# EAGLE design final (EAGLE 8.2.2)
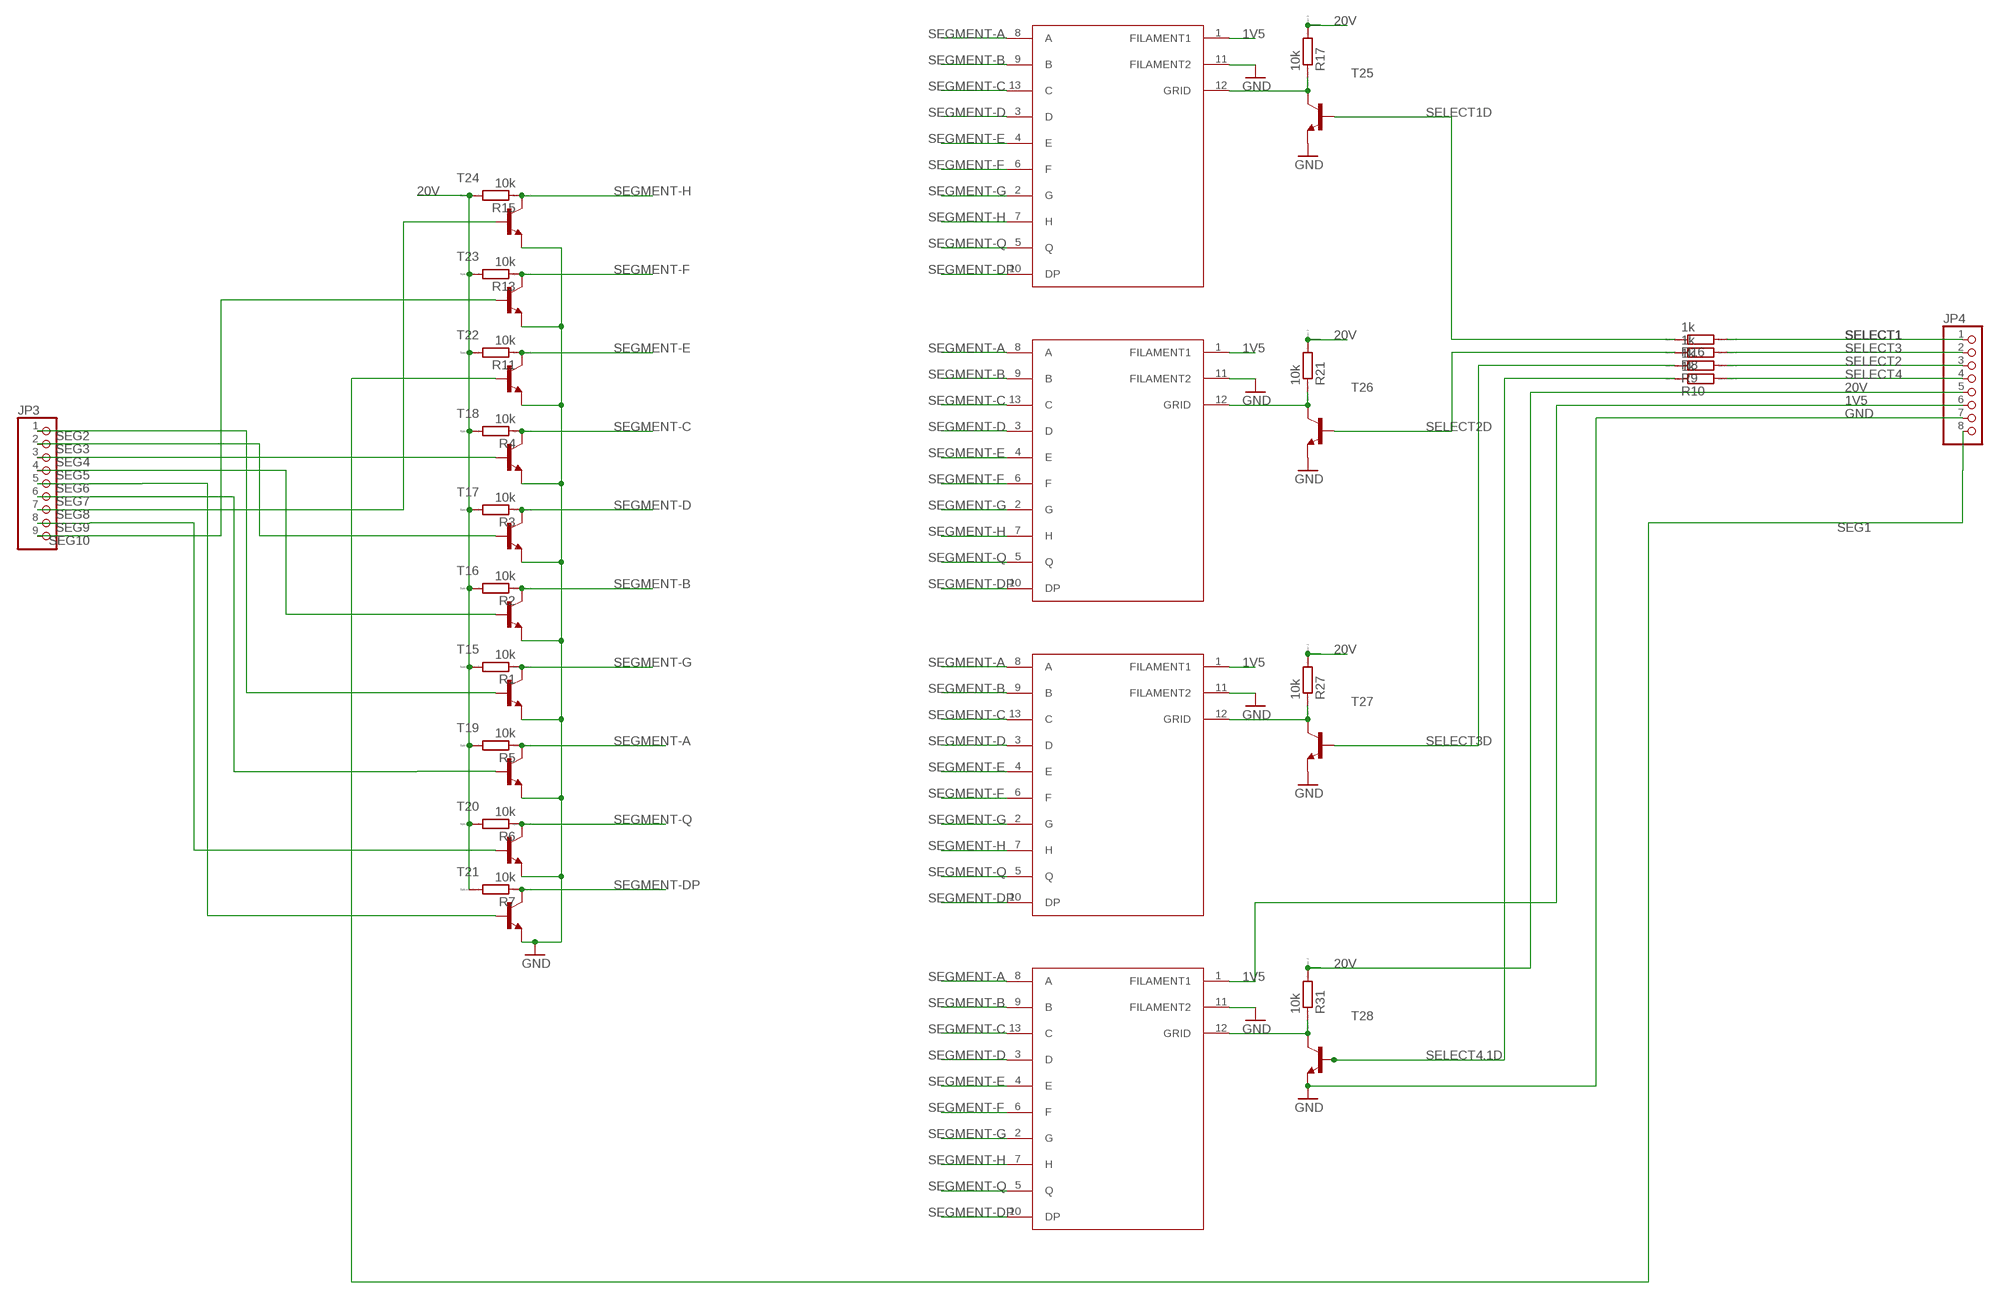
[diagram p0: schematic, sheet 1, part 1 of 2]
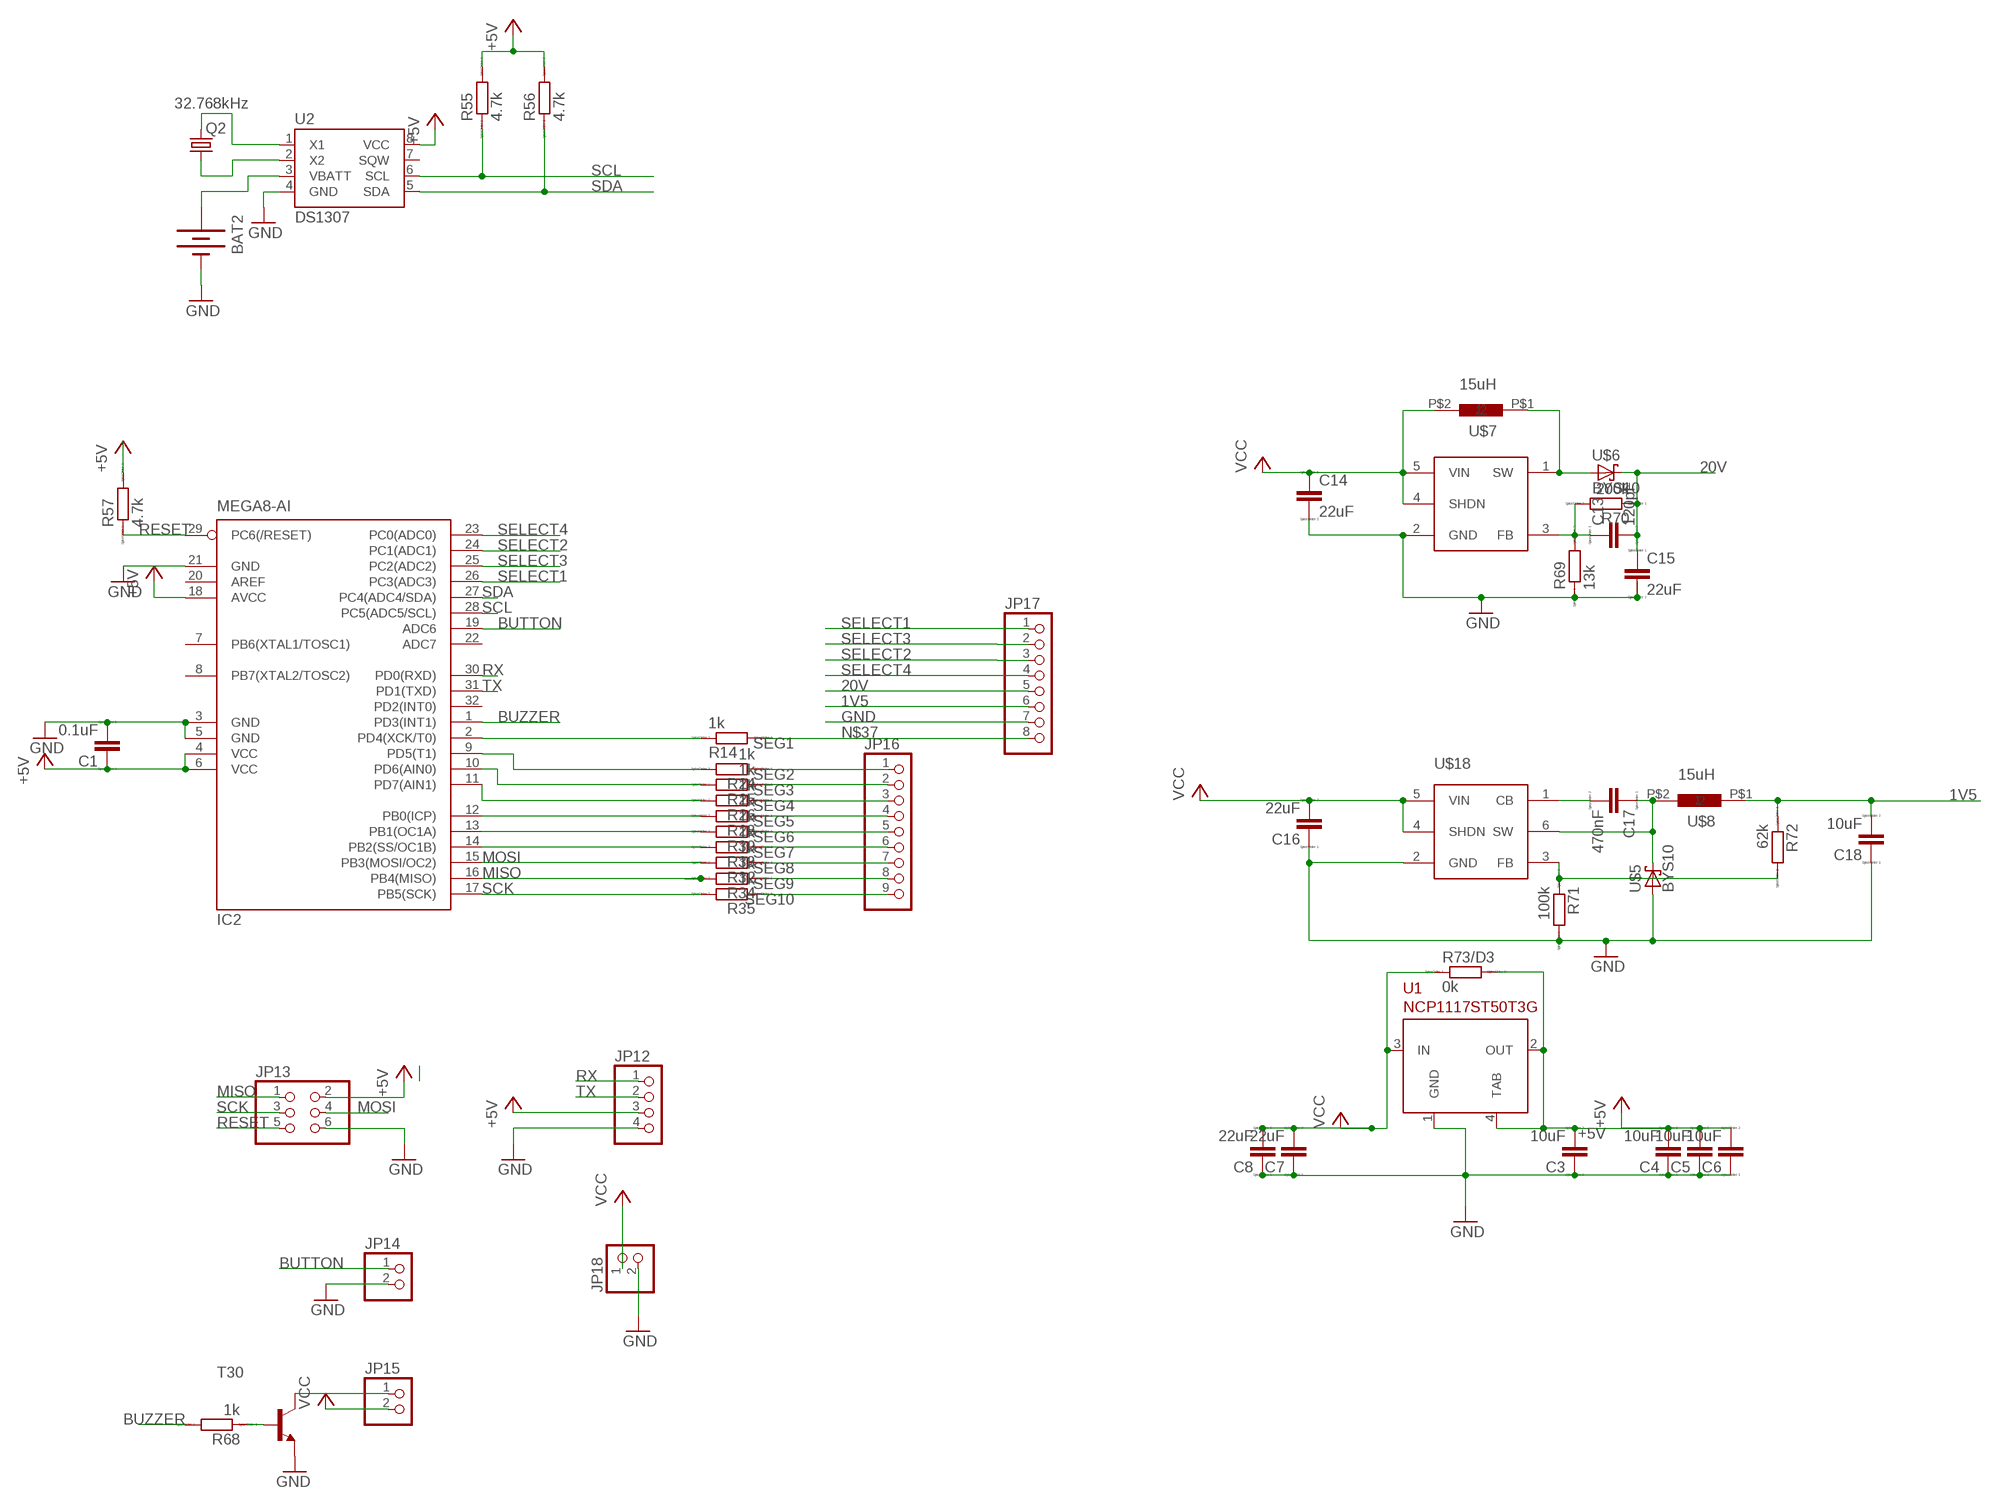
[diagram p1: schematic, sheet 1, part 2 of 2]

## Parts
BAT2  BATTERY12PTH  [BATTCON_12MM_PTH]
C1  0.1uF  CC1206  [C1206]
C3  10uF  CC1206  [C1206]
C4  10uF  CC1206  [C1206]
C5  10uF  CC1206  [C1206]
C6  10uF  CC1206  [C1206]
C7  22uF  CC1206  [C1206]
C8  22uF  CC1206  [C1206]
C13  120pF  CC1206  [C1206]
C14  22uF  CC1206  [C1206]
C15  22uF  CC1206  [C1206]
C16  22uF  CC1206  [C1206]
C17  470nF  CC1206  [C1206]
C18  10uF  CC1206  [C1206]
IC2  MEGA8-AI  [TQFP32-08]
JP3  PINHD-1X9  [1X09]
JP4  PINHD-1X8  [1X08]
JP12  PINHD-1X04_2.54-S  [1X04-S]
JP13  PINHD-2X03_2.54  [2X03]
JP14  PINHD-1X02_2.54  [1X02]
JP15  PINHD-1X02_2.54  [1X02]
JP16  PINHD-1X9  [1X09]
JP17  PINHD-1X8  [1X08]
JP18  PINHD-1X2  [1X02]
Q2  32.768kHz  CRYSTAL32-SMD  [CRYSTAL-32KHZ-SMD]
R1  10k  RR1206  [R1206]
R2  10k  RR1206  [R1206]
R3  10k  RR1206  [R1206]
R4  10k  RR1206  [R1206]
R5  10k  RR1206  [R1206]
R6  10k  RR1206  [R1206]
R7  10k  RR1206  [R1206]
R8  1k  RR1206  [R1206]
R9  1k  RR1206  [R1206]
R10  1k  RR1206  [R1206]
R11  10k  RR1206  [R1206]
R13  10k  RR1206  [R1206]
R14  1k  RR1206  [R1206]
R15  10k  RR1206  [R1206]
R16  1k  RR1206  [R1206]
R17  10k  RR1206  [R1206]
R21  10k  RR1206  [R1206]
R24  1k  RR1206  [R1206]
R25  1k  RR1206  [R1206]
R26  1k  RR1206  [R1206]
R27  10k  RR1206  [R1206]
R28  1k  RR1206  [R1206]
R30  1k  RR1206  [R1206]
R31  10k  RR1206  [R1206]
R32  1k  RR1206  [R1206]
R33  1k  RR1206  [R1206]
R34  1k  RR1206  [R1206]
R35  1k  RR1206  [R1206]
R55  4.7k  RR1206  [R1206]
R56  4.7k  RR1206  [R1206]
R57  4.7k  RR1206  [R1206]
R68  1k  RR1206  [R1206]
R69  13k  RR1206  [R1206]
R70  200k  RR1206  [R1206]
R71  100k  RR1206  [R1206]
R72  62k  RR1206  [R1206]
R73/D3  0k  RR1206  [R1206]
T15  BC817-25-NPN-SOT23-BEC  [SOT23-BEC]
T16  BC817-25-NPN-SOT23-BEC  [SOT23-BEC]
T17  BC817-25-NPN-SOT23-BEC  [SOT23-BEC]
T18  BC817-25-NPN-SOT23-BEC  [SOT23-BEC]
T19  BC817-25-NPN-SOT23-BEC  [SOT23-BEC]
T20  BC817-25-NPN-SOT23-BEC  [SOT23-BEC]
T21  BC817-25-NPN-SOT23-BEC  [SOT23-BEC]
T22  BC817-25-NPN-SOT23-BEC  [SOT23-BEC]
T23  BC817-25-NPN-SOT23-BEC  [SOT23-BEC]
T24  BC817-25-NPN-SOT23-BEC  [SOT23-BEC]
T25  BC817-25-NPN-SOT23-BEC  [SOT23-BEC]
T26  BC817-25-NPN-SOT23-BEC  [SOT23-BEC]
T27  BC817-25-NPN-SOT23-BEC  [SOT23-BEC]
T28  BC817-25-NPN-SOT23-BEC  [SOT23-BEC]
T30  BC817-25-NPN-SOT23-BEC  [SOT23-BEC]
U1  NCP1117ST50T3G  [SOT223]
U2  DS1307  DS1307SO8-TIGHT  [SO08-TIGHT]
U$1  VFD  [ROUND-THT]
U$2  VFD  [ROUND-THT]
U$3  VFD  [ROUND-THT]
U$4  VFD  [ROUND-THT]
U$5  BYS10  [DO-214AC]
U$6  BYS10  [DO-214AC]
U$7  15uH  INDUCTOR  [DJNR5020]
U$8  15uH  INDUCTOR  [DJNR5020]
U$15  LM27313DEV  [SOT-23]
U$18  LMR14206DEV  [SOT-23]

## Nets
1V5: C18.2 JP4.6 JP17.6 R72.1 U$1.1(FILAMENT1) U$2.1(FILAMENT1) U$3.1(FILAMENT1) U$4.1(FILAMENT1) U$8.P$1
20V: C13.2 C15.1 JP4.5 JP17.5 R1.2 R2.2 R3.2 R4.2 R5.2 R6.2 R7.2 R11.2 R13.2 R15.2 R17.2 R21.2 R27.2 R31.2 R70.1 U$6.2(C)
+5V: C1.1 C3.2 C4.2 C5.2 C6.2 IC2.4(VCC) IC2.6(VCC) IC2.18(AVCC) JP12.3 JP13.2 R55.2 R56.2 R57.2 R73/D3.2 U1.2(OUT) U1.4(TAB) U2.8(VCC)
BUTTON: IC2.19(ADC6) JP14.1
BUZZER: IC2.1(PD3(INT1)) R68.2
GND: BAT2.GND(-) C1.2 C3.1 C4.1 C5.1 C6.1 C7.1 C8.1 C14.2 C15.2 C16.1 C18.1 IC2.3(GND) IC2.5(GND) IC2.21(GND) JP4.7 JP12.4 JP13.6 JP14.2 JP17.7 JP18.2 R69.1 R71.2 T15.E T16.E T17.E T18.E T19.E T20.E T21.E T22.E T23.E T24.E T25.E T26.E T27.E T28.E T30.E U1.1(GND) U2.4(GND) U$1.11(FILAMENT2) U$2.11(FILAMENT2) U$3.11(FILAMENT2) U$4.11(FILAMENT2) U$5.1(A) U$15.2(GND) U$18.2(GND)
MISO: IC2.16(PB4(MISO)) JP13.1 R34.2
MOSI: IC2.15(PB3(MOSI/OC2)) JP13.4 R32.2
N$14: R17.1 T25.C U$1.12(GRID)
N$15: IC2.14(PB2(SS/OC1B)) R33.2
N$17: IC2.13(PB1(OC1A)) R30.2
N$18: R21.1 T26.C U$2.12(GRID)
N$19: IC2.12(PB0(ICP)) R28.2
N$21: IC2.11(PD7(AIN1)) R26.2
N$22: R27.1 T27.C U$3.12(GRID)
N$24: R31.1 T28.C U$4.12(GRID)
N$35: IC2.10(PD6(AIN0)) R25.2
N$36: IC2.9(PD5(T1)) R24.2
N$37: IC2.2(PD4(XCK/T0)) R14.1
N$69: Q2.X2 U2.1(X1)
N$70: Q2.X1 U2.2(X2)
N$71: BAT2.VCC@1(+) U2.3(VBATT)
N$79: JP15.1 T30.C
N$80: R68.1 T30.B
N$90: U$6.1(A) U$7.P$1 U$15.1(SW)
N$91: C13.1 R69.2 R70.2 U$15.3(FB)
N$92: R71.1 R72.2 U$18.3(FB)
N$93: C17.1 U$5.2(C) U$8.P$2 U$18.6(SW)
N$94: C17.2 U$18.1(CB)
RESET: IC2.29(PC6(/RESET)) JP13.5 R57.1
RX: IC2.30(PD0(RXD)) JP12.1
SCK: IC2.17(PB5(SCK)) JP13.3 R35.2
SCL: IC2.28(PC5(ADC5/SCL)) R55.1 U2.6(SCL)
SDA: IC2.27(PC4(ADC4/SDA)) R56.1 U2.5(SDA)
SEG1: JP4.8 JP17.8 R14.2 T22.B
SEG2: JP3.1 JP16.1 R24.1 T15.B
SEG3: JP3.2 JP16.2 R25.1 T17.B
SEG4: JP3.3 JP16.3 R26.1 T18.B
SEG5: JP3.4 JP16.4 R28.1 T16.B
SEG6: JP3.5 JP16.5 R30.1 T21.B
SEG7: JP3.6 JP16.6 R33.1 T19.B
SEG8: JP3.7 JP16.7 R32.1 T24.B
SEG9: JP3.8 JP16.8 R34.1 T20.B
SEG10: JP3.9 JP16.9 R35.1 T23.B
SEGMENT-A: R5.1 T19.C U$1.8(A) U$2.8(A) U$3.8(A) U$4.8(A)
SEGMENT-B: R2.1 T16.C U$1.9(B) U$2.9(B) U$3.9(B) U$4.9(B)
SEGMENT-C: R4.1 T18.C U$1.13(C) U$2.13(C) U$3.13(C) U$4.13(C)
SEGMENT-D: R3.1 T17.C U$1.3(D) U$2.3(D) U$3.3(D) U$4.3(D)
SEGMENT-DP: R7.1 T21.C U$1.10(DP) U$2.10(DP) U$3.10(DP) U$4.10(DP)
SEGMENT-E: R11.1 T22.C U$1.4(E) U$2.4(E) U$3.4(E) U$4.4(E)
SEGMENT-F: R13.1 T23.C U$1.6(F) U$2.6(F) U$3.6(F) U$4.6(F)
SEGMENT-G: R1.1 T15.C U$1.2(G) U$2.2(G) U$3.2(G) U$4.2(G)
SEGMENT-H: R15.1 T24.C U$1.7(H) U$2.7(H) U$3.7(H) U$4.7(H)
SEGMENT-Q: R6.1 T20.C U$1.5(Q) U$2.5(Q) U$3.5(Q) U$4.5(Q)
SELECT1: IC2.26(PC3(ADC3)) JP4.1 JP17.1 R16.2
SELECT1D: R16.1 T25.B
SELECT2: IC2.24(PC1(ADC1)) JP4.3 JP17.3 R9.2
SELECT2D: R8.1 T26.B
SELECT3: IC2.25(PC2(ADC2)) JP4.2 JP17.2 R8.2
SELECT3D: R9.1 T27.B
SELECT4: IC2.23(PC0(ADC0)) JP4.4 JP17.4 R10.2
SELECT4.1D: R10.1 T28.B
TX: IC2.31(PD1(TXD)) JP12.2
VCC: C7.2 C8.2 C14.1 C16.2 JP15.2 JP18.1 R73/D3.1 U1.3(IN) U$7.P$2 U$15.4(SHDN) U$15.5(VIN) U$18.4(SHDN) U$18.5(VIN)
Unconnected: IC2.7(PB6(XTAL1/TOSC1)) IC2.8(PB7(XTAL2/TOSC2)) IC2.20(AREF) IC2.22(ADC7) IC2.32(PD2(INT0)) U2.7(SQW)

## Library data of the parts
BAT2 = SparkFun-Electromechanical:BATTERY: Battery Holders Various common sizes : AA, AAA, 20mm coin cell and 12mm coin cell. 20MM_4LEGS, BATT-10373
C1 C3-C8 C13-C18 = eagle-ltspice:C: CAPACITOR, European symbol; SPICEMODEL: NONE; SPICEPREFIX: C
IC2 = atmel:MEGA8: MICROCONTROLLER 8 Kbytes FLASH, 1 kbytes SRAM, 512 bytes EEPROM, USART, 6-channel 10 bit ADC, 2-channel 8 bit ADC Pin compatible with Atmega48, ATMega88, ATMega168 Source: avr.lbr; MPN: ATMEGA8-16AU; OC_FARNELL: 9171371; OC_NEWARK: 73M8863
JP3 JP16 = pinhead:PINHD-1X9: PIN HEADER
JP4 JP17 = pinhead:PINHD-1X8: PIN HEADER
JP12 = pinhead-2:PINHD-1X04: PIN HEADER
JP13 = pinhead-2:PINHD-2X03: PIN HEADER
JP14 JP15 = pinhead-2:PINHD-1X02: PIN HEADER
JP18 = pinhead:PINHD-1X2: PIN HEADER
Q2 = SparkFun-FreqCtrl:CRYSTAL: Various standard crystals. Proven footprints. Spark Fun Electronics SKU : COM-00534
R1-R11 R13-R17 R21 R24-R28 R30-R35 R55-R57 R68-R72 R73/D3 = eagle-ltspice:R: RESISTOR, European symbol; SPICEMODEL: NONE; SPICEPREFIX: R
T15-T28 T30 = transistor:*-NPN-: NPN Transistror BF959 corrected 2008.03.06
U1 = NCP1117ST50T3G:NCP1117ST50T3G: NCP1117 5V, 1.0 A Low-Dropout Positive Fixed and Adjustable Voltage Regulator Datasheet <http://www.onsemi.com/pub_link/Collateral/NCP1117-D.PDF>; AVAILABILITY: Good; DESCRIPTION: 1.0 A Positive LDO Linear Voltage Regulator (Fixed and Adjustable) Vout: 5.0 V; MF: ON Semiconductor; MP: NCP1117ST50T3G; PACKAGE: TO-261-4 ON Semiconductor; PRICE: 0.22 USD
U2 = SparkFun-FreqCtrl:DS1307: I2C real-time clock with battery backup.
U$1-U$4 = VFD:VFD
U$5 U$6 = BYS10-25:BYS10
U$7 U$8 = djnr5020:INDUCTOR
U$15 = LM27313:LM27313DEV
U$18 = LMR14206:LMR14206DEV

## Net classes
1 gnd: width 2.54 mm

## Board
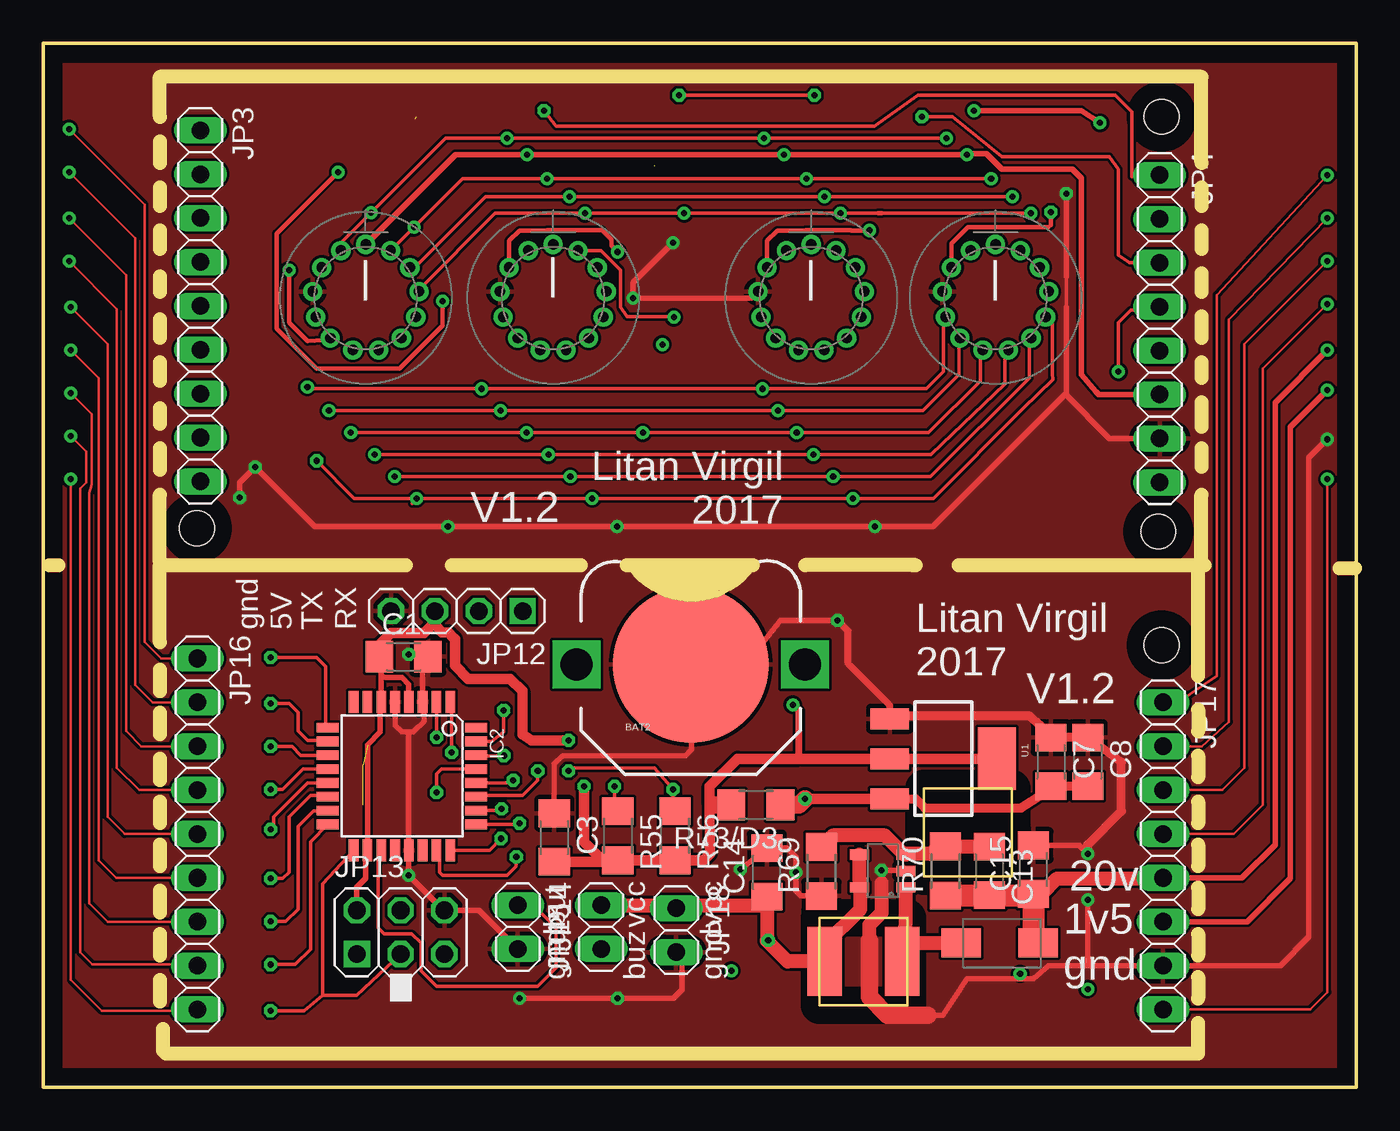
[diagram p2: board, top side]
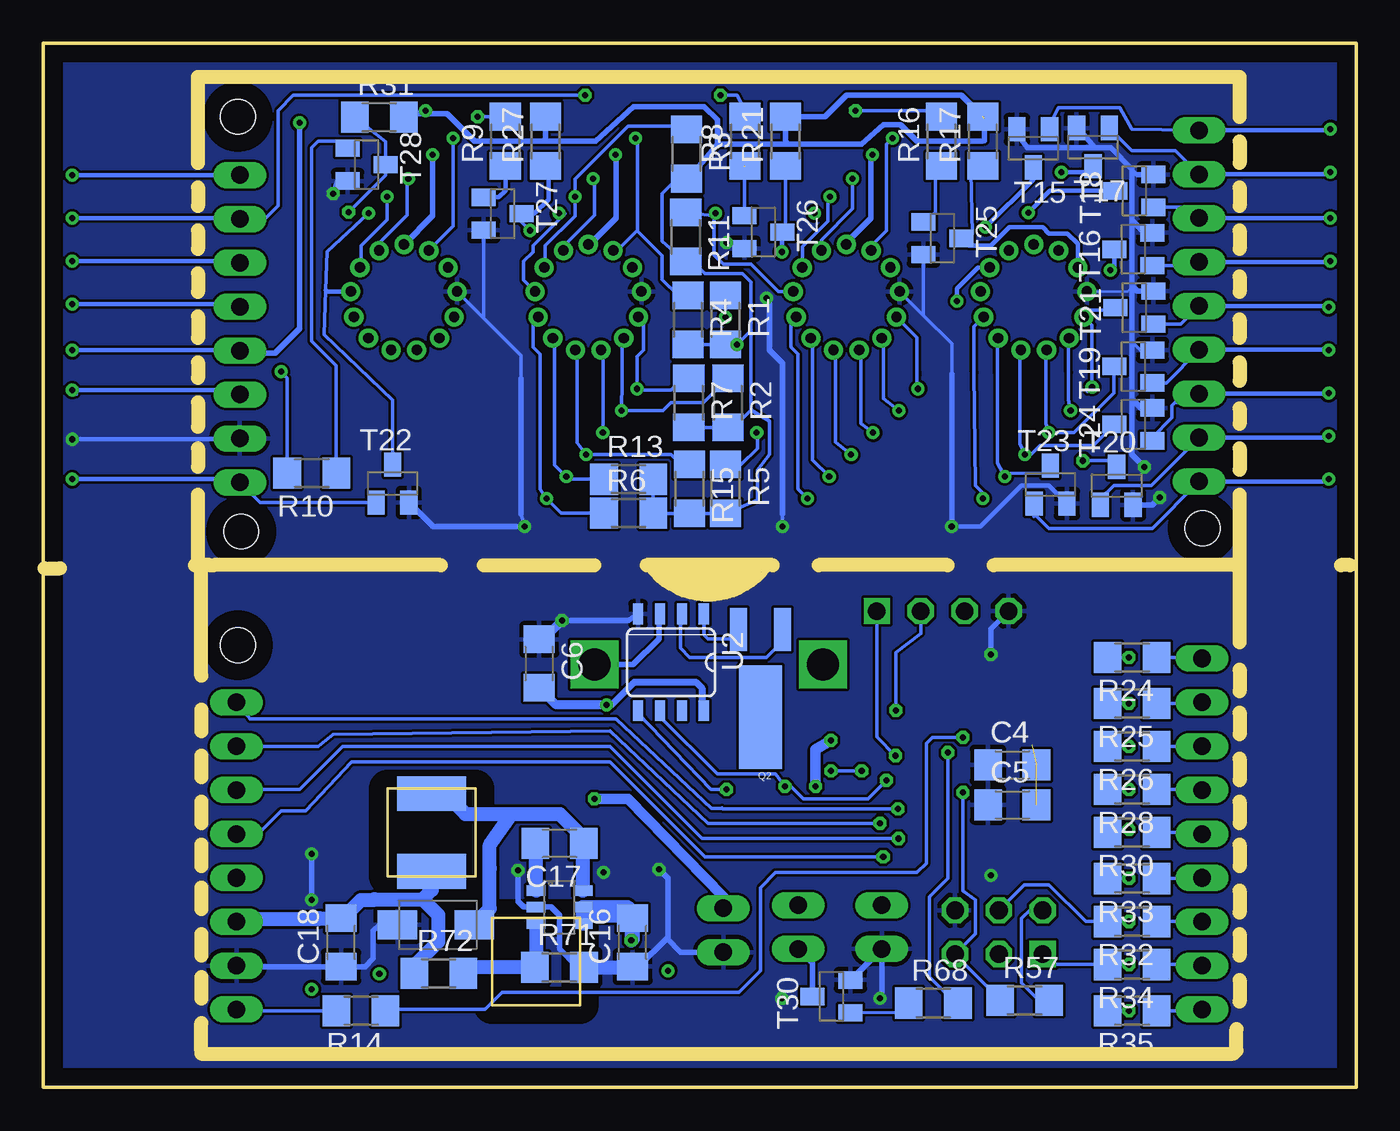
[diagram p3: board, bottom side, seen from below]

Size 76 x 60.44 mm. Coordinates in mm from the lower left corner, seen from the top.
Outline: 0,0 76,0 76,60.44 0,60.44 0,0
Copper layers (1*16): Top 0.035mm / dielectric 1.5mm / Bottom 0.035mm
Design rules "default": minimum track width 6mil, minimum drill 0.35mm, track to track 6mil, track to pad 6mil, pad to pad 6mil, via to via 6mil, smd to smd 6mil, copper to edge 40mil, drill to drill 6mil, minimum pad ring 10mil, minimum via ring 8mil, stop-mask expansion 4mil, vias tented up to drill 0mil, thermal gap 10mil
Holes 2 mm at 64.72,56.18 64.54,32.18 8.89,32.36 64.72,25.6
Milling: 77 lines

### Footprints (pad centres in the part's own frame; a part is rotated, then mirrored left to right if it is on the bottom)
BATTCON_12MM_PTH = smd 9 x 9: GND 0,0 | drill 1.854 square: VCC@1 6.604,0; VCC@2 -6.604,0
C1206 = smd 1.6 x 1.8: 1 -1.4,0; 2 1.4,0
TQFP32-08 = smd 1.27 x 0.559: 1 -4.293,2.8; 2 -4.293,2; 3 -4.293,1.2; 4 -4.293,0.4; 5 -4.293,-0.4; 6 -4.293,-1.2; 7 -4.293,-2; 8 -4.293,-2.8; 17 4.293,-2.8; 18 4.293,-2; 19 4.293,-1.2; 20 4.293,-0.4; 21 4.293,0.4; 22 4.293,1.2; 23 4.293,2; 24 4.293,2.8 | smd 0.559 x 1.27: 9 -2.8,-4.293; 10 -2,-4.293; 11 -1.2,-4.293; 12 -0.4,-4.293; 13 0.4,-4.293; 14 1.2,-4.293; 15 2,-4.293; 16 2.8,-4.293; 25 2.8,4.293; 26 2,4.293; 27 1.2,4.293; 28 0.4,4.293; 29 -0.4,4.293; 30 -1.2,4.293; 31 -2,4.293; 32 -2.8,4.293
1X09 = drill 1.016 long: 1 -10.16,0; 2 -7.62,0; 3 -5.08,0; 4 -2.54,0; 5 0,0; 6 2.54,0; 7 5.08,0; 8 7.62,0; 9 10.16,0
1X08 = drill 1.016 long: 1 -8.89,0; 2 -6.35,0; 3 -3.81,0; 4 -1.27,0; 5 1.27,0; 6 3.81,0; 7 6.35,0; 8 8.89,0
1X04-S = drill 1.016 square: 1 -3.81,0 | drill 1.016 octagon: 2 -1.27,0; 3 1.27,0; 4 3.81,0
2X03 = drill 1.016 square: 1 -2.54,-1.27 | drill 1.016 octagon: 2 -2.54,1.27; 3 0,-1.27; 4 0,1.27; 5 2.54,-1.27; 6 2.54,1.27
1X02 = drill 1.016 long: 1 -1.27,0; 2 1.27,0
CRYSTAL-32KHZ-SMD = smd 2.5 x 6: SHEILD 0,5.08 | smd 1 x 2.5: X1 -1.27,0; X2 1.27,0
R1206 = smd 1.6 x 1.803: 1 -1.422,0; 2 1.422,0
SOT23-BEC = smd 1 x 1.4: B -0.95,-1.1; C 0,1.1; E 0.95,-1.1
SOT223 = smd 1.219 x 2.235: 1 -2.311,-3.099; 2 0,-3.099; 3 2.311,-3.099 | smd 3.6 x 2.2: 4 0,3.099
SO08-TIGHT = smd 0.6 x 1.2: 1 -1.905,-2.8; 2 -0.635,-2.8; 3 0.635,-2.8; 4 1.905,-2.8; 5 1.905,2.8; 6 0.635,2.8; 7 -0.635,2.8; 8 -1.905,2.8
ROUND-THT = drill 0.6 pad 1.016: 1 0,3.1; 2 1.441,2.745; 3 2.551,1.761; 4 3.077,0.374; 5 2.899,-1.099; 6 2.056,-2.32; 7 0.742,-3.01; 8 -0.742,-3.01; 9 -2.056,-2.32; 10 -2.899,-1.099; 11 -3.077,0.374; 12 -2.551,1.761; 13 -1.441,2.745
DO-214AC = smd 2.286 x 1.676: 1 -2.335,0; 2 2.11,0
DJNR5020 = smd 2 x 4: P$1 -2.25,0; P$2 2.25,0
SOT-23 = smd 1.1 x 0.6: 1 -1.35,0.95; 2 -1.35,0; 3 -1.35,-0.95; 4 1.35,-0.95; 5 1.35,0.95
SOT-23' = smd 1.1 x 0.6: 1 -1.35,0.95; 2 -1.35,0; 3 -1.35,-0.95; 4 1.35,-0.95; 5 1.35,0; 6 1.35,0.95

### Placement (x,y rotation side)
BAT2  37.48,24.47 0 top
C1  20.86,24.93 0 top
C3  29.58,14.46 270 top
C4  19.91,18.67 0 bottom
C5  19.91,16.36 0 bottom
C6  47.29,24.54 270 bottom
C7  58.32,18.85 270 top
C8  60.45,18.85 270 top
C13  54.75,12.53 270 top
C14  41.88,12.45 90 top
C15  57.31,12.61 90 top
C16  41.88,8.4 90 bottom
C17  46.12,14.13 180 bottom
C18  58.75,8.39 90 bottom
IC2  20.76,18.02 270 top
JP3  9.09,45.24 270 top
JP4  64.62,43.92 270 top
JP12  23.94,27.57 180 top
JP13  20.69,8.98 0 top
JP14  27.47,9.28 270 top
JP15  32.29,9.28 90 top
JP16  8.93,14.67 270 top
JP17  64.81,13.4 270 top
JP18  36.64,9.1 270 top
Q2  34.48,26.51 180 bottom
R1  36.5,44.42 270 bottom
R2  36.37,39.62 270 bottom
R3  38.76,54.03 270 bottom
R4  38.68,44.42 270 bottom
R5  36.5,34.65 270 bottom
R6  42.11,33.25 0 bottom
R7  38.63,39.62 270 bottom
R8  35.38,54.76 90 bottom
R9  49.25,54.76 90 bottom
R10  60.45,35.56 180 bottom
R11  38.81,49.23 270 bottom
R13  42.11,35.2 0 bottom
R14  57.61,4.45 180 bottom
R15  38.58,34.65 270 bottom
R16  24,54.76 90 bottom
R17  21.62,54.76 90 bottom
R21  33.05,54.76 90 bottom
R24  12.98,24.89 180 bottom
R25  12.98,22.23 180 bottom
R26  12.98,19.74 180 bottom
R27  46.91,54.76 90 bottom
R28  12.98,17.25 180 bottom
R30  12.98,14.76 180 bottom
R31  56.54,56.16 0 bottom
R32  12.98,9.6 180 bottom
R33  12.98,12.09 180 bottom
R34  12.98,7.11 180 bottom
R35  12.98,4.45 180 bottom
R55  33.26,14.57 270 top
R56  36.56,14.57 270 top
R57  19.19,5.04 0 bottom
R68  24.48,4.89 0 bottom
R69  45.04,12.5 90 top
R70  52.21,12.53 90 top
R71  46.12,6.95 0 bottom
R72  53.1,6.6 0 bottom
R73/D3  41.25,16.36 180 top
T15  18.69,54.36 180 bottom
T16  12.9,48.51 90 bottom
T17  15.24,54.43 180 bottom
T18  12.85,51.89 90 bottom
T19  12.9,41.73 90 bottom
T20  13.87,34.82 0 bottom
T21  12.85,45.14 90 bottom
T22  55.78,34.95 0 bottom
T23  17.7,34.9 0 bottom
T24  12.9,38.38 90 bottom
T25  23.95,49.15 270 bottom
T26  34.32,49.5 270 bottom
T27  49.4,50.57 270 bottom
T28  57.28,53.42 270 bottom
T30  30.38,5.27 90 bottom
U1  52.1,19.02 270 top
U2  39.66,24.6 180 bottom
U$1  18.67,45.69 0 top
U$2  29.51,45.69 0 top
U$3  44.45,45.69 0 top
U$4  55.12,45.69 0 top
U$5  53.16,9.42 0 bottom
U$6  55.47,8.36 0 top
U$7  47.47,7.29 180 top
U$8  53.52,14.76 90 bottom
U$15  48.58,12.53 180 top
U$18  [SOT-23']  46.11,10.44 0 bottom

### Tracks (layer width: path | path; a pad name or v marks a point on that pad's centre or on a via)
1V5  (via drill 0.35)
  Top 0.203: 28.23,54 v28.02,54
  Top 0.305: JP17.6 69.69,9.59 72.19,12.09 72.19,38.23 v74.32,40.36 | 28.23,54 v42.87,54 v53.47,54 53.52,54.05 54.59,54.05 55.47,53.16 59.56,53.16 60.1,52.63 60.1,41.25 60.92,40.28 | 60.92,40.28 61.06,40.11 | JP4.6 61.09,40.11 60.92,40.28 | v28.02,54 23.88,54 U$1.1
  Bottom 0.152: 74.07,40.11 v74.32,40.36
  Bottom 0.2: 58.69,9.85 58.4,10.15 58.32,10.23
  Bottom 0.254: v74.32,40.36 64.87,40.36 JP4.6
  Bottom 0.305: 53.19,8.38 53.12,8.45 | 58.25,10.15 58.4,10.15 | v53.47,54 53.47,50.45 U$4.1 | U$3.1 44.37,48.8 42.85,50.32 42.85,53.98 v42.87,54 | U$2.1 29.52,48.9 28.09,50.32 28.09,53.92 v28.02,54
  Bottom 0.813: 58.32,10.21 58.25,10.15 | C18.2 60,9.79 60.06,9.73 64.67,9.73 JP17.6 | R72.1 54.52,7.04 53.19,8.38 | 53.12,8.45 53.12,9.97 54.04,10.9 | 54.04,10.9 56.84,10.9 56.9,10.85 57.61,10.85 58.66,9.79 C18.2 | 58.69,9.85 C18.2 | U$8.P$1 53.52,11.42 54.04,10.9
20V  (via drill 0.35)  (1 unrouted)
  Top 0.2: 55.59,11.13 54.77,11.13 C13.2
  Top 0.305: v53.87,56.54 60.1,56.54 v61.16,55.83 | JP17.5 69.38,12.13 71.3,14.05 71.3,39.65 v74.32,42.67
  Top 0.813: C15.1 57.79,11.21 58.67,12.09 64.77,12.09 JP17.5
  Top 1.27: R70.1 54.74,11.11 54.77,11.13 | C13.2 57.23,11.13 C15.1 57.31,8.63 U$6.2
  Bottom 0.152: 74.3,42.65 v74.32,42.67
  Bottom 0.2: 55.32,56.72 R31.2 | JP4.5 64.47,42.49 | 21.67,54.76 21.51,54.79 | 33.05,54.63 33.03,54.61 32.86,54.61 32.89,54.59 | 46.91,54.88 47.03,54.76 | 38.76,52.45 R3.2 39.5,52.43 40.18,51.74 40.18,49 R11.2 38.2,47.62 37.69,47.12 35.53,47.12 35.03,46.61 35.03,43.81 | 35.03,43.81 35.03,39.19 | 35.03,39.19 33.96,38.58 33.96,36.63 34.67,35.74 34.67,33.99 R5.2 R15.2 40.49,33.22 R6.2 R13.2 | R7.2 R2.2 36.02,38.2 35.03,39.19 | R4.2 R1.2 v35.84,43 35.03,43.81
  Bottom 0.254: v74.32,42.67 64.64,42.67 JP4.5
  Bottom 0.305: v61.16,55.83 61.16,43.92 62.59,42.49 64.47,42.49 | 47.03,54.76 44.02,54.76 41.83,56.77 37.74,56.77 36.98,56.01 36.98,54.59 | 32.86,54.61 28.65,54.61 27.36,55.73 26.39,55.73 25.43,54.76 21.67,54.76 | 21.51,54.79 21.51,56.08 | 36.98,54.59 38.76,52.45 | 36.98,54.59 32.89,54.59 33.05,54.74 R21.2 30.76,56.18 29.52,57.43 22.86,57.43 21.84,56.41 | 47.03,54.76 51.03,54.76 52.63,56.36 55.09,56.36 R31.2 54.43,56.34 v53.87,56.54 | R27.2 46.91,54.88 47.03,54.76
+5V  (via drill 0.35)  (2 unrouted)
  Top 0.2: 19.56,25.11 19.56,24 19.82,23.74 | 19.56,25.21 19.56,25.11 | 18.86,13.64 IC2.18 18.67,13.64 | 19.49,22.25 IC2.6 | C1.1 19.46,25.01 19.56,25.11 | C1.1 19.78,24.93 | C1.1 20.03,24.93 | 22.58,26.67 22.58,27.49 JP12.3 | 32.81,13.06 R55.2 32.37,13.15
  Top 0.305: IC2.6 19.56,24 | IC2.4 21.16,23.34 20.76,23.74 19.82,23.74 | IC2.18 18.76,19.83 19.49,20.56 19.49,22.25 | 18.15,10.47 18.15,11.57 18.67,12.09 18.67,13.64 | 20.13,26.31 22.23,26.31 22.58,26.67 | JP12.3 22.67,26.94 22.67,26.76 | 23.7,26.08 23.82,25.96
  Top 0.406: 43.74,19.02 43.74,21.79 v43.38,22.14 | 38.95,16.36 38.61,16.36 38.58,16.39
  Top 0.61: 32.81,13.06 C3.2 | R55.2 R56.2 38.22,13.15 38.58,13.51 38.58,16.39 38.57,17.41 40.18,19.02 43.74,19.02 U1.2 U1.4 | 32.37,13.15 31.29,14.22 v31.29,17.42 | v30.4,20.09 28.27,20.09 27.74,20.45 27.74,22.94 27.03,23.65 24.6,23.65 23.82,24.42 23.82,25.96 | C1.1 19.46,25.65 20.13,26.31 22.04,26.31 22.67,26.94 | JP12.3 22.67,26.76 23.09,26.34 23.45,26.34 23.7,26.08
  Top 0.813: JP13.2 18.15,10.47 | C1.1 19.46,25.11 19.56,25.21
  Top 1.016: R73/D3.2 38.95,16.36
  Bottom 0.2: R57.2 18.38,5.04 19.38,6.04 19.38,9.78 18.85,10.31 18.21,10.31 JP13.2
  Bottom 0.305: 42.85,22.4 41.78,23.47
  Bottom 0.406: v43.38,22.14 43.11,22.14 41.78,23.47 38.23,23.47 37.87,23.11 37.87,21.91 U2.8
  Bottom 0.508: v43.38,22.14 46.3,22.14 C6.2
  Bottom 0.61: v31.29,17.42 31.29,19.56 v30.4,20.09
BUTTON
  Top 0.2: JP14.1 28.39,10.55 29.69,9.25 29.69,6.93 28.63,5.87 22.76,5.87 21.87,6.76 21.87,8.36 21.34,8.89 19.74,8.89 19.38,9.25 19.38,13.55 IC2.19
BUZZER  (via drill 0.35)
  Top 0.2: v23.65,19.38 23.65,22.41 IC2.1
  Bottom 0.2: v23.65,19.38 23.65,12.09 24.71,11.02 24.71,6.4 23.2,4.89 R68.2
GND  (via drill 0.35)
  Top 0.2: 49.38,12.53 U$15.2 | 22.03,22.25 IC2.3 | 21.16,20.47 21.07,20.56 | 21.34,13.56 IC2.21 | 21.96,24.63 C1.2 21.3,24.93 v21.16,25.07 | 41.89,13.87 C14.2 41.72,13.69 | 58.2,7.05 58.18,7.03 | 39.89,23.54 BAT2.GND 37.48,23.71 | 37.48,23.71 37.48,21.73 37.69,21.51 | 37.52,23.68 37.48,23.71 | 29.54,15.82 C3.1 | 36.98,7.49 JP18.2 | 59.16,40.13 59.21,40.18 | 60.45,7.06 61.7,7.05 | 59.21,45.16 59.21,47.1
  Top 0.305: IC2.3 21.96,24.63 | IC2.5 20.36,20.96 20.76,20.56 21.07,20.56 21.4,20.56 22.03,21.2 22.03,22.25 | 21.16,13.88 IC2.21 | 21.16,13.88 21.16,20.47 | 58.18,7.03 57.3,6.29 53.45,6.29 52.06,4.19 51.21,4.19 | 48.54,10.13 48.54,10.31 | 48.53,11.82 v48.52,12.56 49.38,12.56 | R69.1 43.86,11.08 43.56,11.38 v43.56,12.45 43.56,13.34 43.03,13.87 41.89,13.87 | v40.36,12.62 41.72,13.69 | 58.2,7.05 61.7,7.05 JP17.7 71.59,7.05 73.25,8.71 73.25,36.45 v74.32,37.52 | 39.89,23.54 42.67,27.03 v45.98,27.03 | C3.1 29.58,18.73 30.05,19.2 37.16,19.2 37.52,19.56 37.52,23.68 | 56.87,14.63 C15.2 59.96,14.01 v60.45,13.51 | JP14.2 25.23,10.25 JP13.6 23.18,10.25 v21.16,12.27 21.16,13.88 | 36.98,7.49 36.98,5.67 36.47,5.16 v33.25,5.16 v27.56,5.16 | 59.21,40.18 59.21,45.16 | v59.21,51.74 59.21,47.1 59.21,46.93 | v11.38,34.14 11.38,35.03 v12.27,35.92 15.72,32.46 v23.42,32.46 v33.21,32.46 v48.13,32.46 51.49,32.46 59.16,40.13 61.72,37.57 JP4.7 | v60.45,10.85 60.45,7.06 | v36.45,48.9 34.14,46.58 v34.14,45.7 41,45.7 U$3.11
  Top 0.406: U1.1 49,21.66 49,22.12 46.58,24.54 46.58,26.43 v45.98,27.03
  Top 0.508: v60.45,13.51 60.45,14.05 62.41,16 62.41,18.82 C8.1 C7.1 58.5,20.27 57.07,21.51 50.09,21.51 49,21.66
  Top 0.813: 48.54,10.13 47.81,9.41 47.81,8.52 | 48.54,10.31 48.54,11.81 48.53,11.82
  Top 1.016: 51.21,4.19 48.86,4.19 47.81,5.24 47.81,8.52
  Bottom 0.152: 74.27,37.57 v74.32,37.52 | U$1.11 13.25,46.07 12.98,46.34
  Bottom 0.2: v33.21,32.46 33.22,33.18 | v48.13,32.46 48.34,33.2 | T26.E 34.8,48.38 | 46.12,8.01 46.12,7.96 | 44.91,6.75 44.71,6.95 R71.2 45.06,6.95 | C16.1 41.54,7 | 39.9,8.63 39.83,8.71 | 56.54,9.42 56.36,9.25 55.94,9.33 55.85,9.42 U$5.1 | 29.26,6.22 T30.E | T28.E 58.91,52.57 | 12.45,34.2 T20.E | 16.19,55.34 T17.E 16.09,55.53 | 12.41,52.84 T18.E | 12.17,49.46 T16.E 12.25,49.46 | 12.29,46.09 T21.E | T15.E 19.64,55.2 | 12.66,52.84 12.98,53.16 | T19.E 12.49,42.68 12.98,43.17 | T24.E 12.46,39.33 | 64.75,6.99 JP17.7 | 27.81,7.67 JP14.2 | 48.34,41.02 48.34,42.36 50.5,44.53 | 50.5,44.53 U$4.11 | T27.E 50.5,44.53 | 23.42,41.3 23.42,43.05 25.05,44.68 | 25.05,44.68 U$2.11 | T25.E 25.05,44.68
  Bottom 0.254: v23.42,32.46 21.77,32.46 19.38,34.85 17.8,34.85 T23.E | v74.32,37.52 64.67,37.52 JP4.7
  Bottom 0.305: v48.52,12.56 48.52,10.76 48.21,10.44 U$18.2 46.61,10.44 46.12,9.95 46.12,8.01 45.06,6.95 | 56.54,9.42 56.9,9.07 56.9,7.47 57.37,6.99 C18.1 64.75,6.99 | 41.54,7 39.9,8.63 39.1,7.83 JP18.2 | 39.83,8.71 39.83,12.09 v40.36,12.62 | v45.98,27.03 42.12,27.03 U2.4 | v21.16,25.07 21.16,26.54 JP12.4 | 27.81,7.67 29.26,6.22 | v48.13,32.46 53.44,32.46 T22.E | 58.91,52.57 v59.21,51.74 | 19.64,55.2 19.02,54.41 15.14,54.41 | 15.14,54.41 15.08,54.41 14.89,54.4 14.22,54.4 12.98,53.16 12.98,50.19 | 12.98,46.4 12.98,50.19 | 12.98,46.4 12.98,46.34 12.98,43.17 12.98,39.85 | 12.98,39.85 12.98,36.63 v12.27,35.92 | T20.E 11.79,33.72 v11.38,34.14 | 16.09,55.53 15.14,54.41 | T18.E 12.66,52.84 | 12.25,49.46 12.98,50.19 | T21.E 12.67,46.09 12.98,46.4 | 12.46,39.33 12.98,39.85 | v60.45,13.51 v60.45,10.85 | JP14.2 27.47,5.25 v27.56,5.16 | v23.42,32.46 23.42,41.3 | 48.34,33.2 48.34,41.02 | 33.22,33.18 33.22,41.94 33.96,42.67 33.96,45.52 v34.14,45.7 | v36.45,48.9 35.76,48.9 T26.E
  Bottom 0.508: C6.1 47.06,25.94 v45.98,27.03
  Bottom 0.813: R71.2 41.93,6.95 C16.1
  pour Top: 0.89,59.39 75.39,59.39 75.74,59.03 75.74,1.24 74.68,0.18 1.96,0.18 0.36,1.78 0.36,58.67
  pour Bottom: 75.21,0.89 75.21,59.21 74.32,60.1 1.24,60.1 0.89,59.74 0.89,1.42 1.6,0.71 75.03,0.71
MISO  (via drill 0.35)
  Top 0.2: v13.16,7.11 14.58,7.11 15.47,8 15.47,14.22 IC2.16
  Bottom 0.2: v13.16,7.11 R34.2 17.55,7.11 JP13.1
MOSI  (via drill 0.35)
  Top 0.2: v13.16,9.6 14.05,9.6 14.76,10.31 14.76,15.11 15.65,16 16.45,16 IC2.15
  Bottom 0.2: v13.16,9.6 R32.2 15.65,9.6 17.78,11.73 19.2,11.73 JP13.4
N$3  (via drill 0.35)
  other vias: 56.54,6.58
N$4  (via drill 0.35)
  other vias: 60.45,5.69
N$5  (via drill 0.35)
  other vias: 39.83,6.76
N$14
  Bottom 0.2: T25.C 22.5,49.33 22.23,49.43 22.32,52.99 R17.1
  Bottom 0.254: U$1.12 16.12,48.83 16.71,49.43 17.78,49.43 18.14,49.78 20.09,49.78 21.16,48.72 22.42,48.72 T25.C
N$15  (via drill 0.35)
  Top 0.2: v13.16,12.09 13.87,12.09 14.22,12.45 14.22,15.65 15.47,16.89 16.4,16.89 IC2.14
  Bottom 0.2: R33.2 v13.16,12.09
N$17  (via drill 0.35)
  Top 0.2: IC2.13 15.31,17.62 13.34,15.65 13.34,15.11 v13.16,14.94
  Bottom 0.2: v13.16,14.94 14.22,14.94 R30.2
N$18  (via drill 0.35)
  Top 0.254: U$2.12 26.96,49.01 27.56,49.61 29.15,49.61 29.17,49.63 32.34,49.63 32.89,49.07 32.89,48.72 v33.25,48.36
  Bottom 0.2: T26.C 33.18,49.29 33.05,49.43 R21.1
  Bottom 0.254: v33.25,48.36 33.25,49.47 T26.C
N$19  (via drill 0.35)
  Top 0.2: IC2.12 15.04,18.42 13.87,17.25 v13.16,17.25
  Bottom 0.2: v13.16,17.25 R28.2
N$21  (via drill 0.35)
  Top 0.2: IC2.11 14.91,19.22 R26.2 v13.16,19.74
  Bottom 0.2: v13.16,19.74 R26.2
N$22  (via drill 0.35)
  Top 0.254: U$3.12 41.9,49.01 42.49,49.61 44.08,49.61 44.1,49.63 46.74,49.63 46.76,49.61 v47.83,49.61
  Bottom 0.2: T27.C 48.3,50.08 v47.83,49.61
  Bottom 0.254: T27.C 47.57,50.57 46.76,51.38 46.76,53.19 R27.1
N$24  (via drill 0.35)
  Top 0.254: U$4.12 52.57,48.83 53.52,49.78 58.18,49.78 58.32,49.92 v58.32,50.67
  Bottom 0.2: v58.32,50.67 56.18,52.81 T28.C 56.18,54.73 R31.1
N$35  (via drill 0.35)
  Top 0.2: v13.16,22.23 14.22,22.23 14.76,21.69 14.76,20.62 15.29,20.09 16.4,20.09 IC2.10
  Bottom 0.2: R25.2 v13.16,22.23
N$36  (via drill 0.35)
  Top 0.2: IC2.9 16.36,20.94 16.36,24.36 15.82,24.89 v13.16,24.89
  Bottom 0.2: R24.2 v13.16,24.89
N$37  (via drill 0.35)
  Top 0.2: IC2.2 v22.76,20.27
  Bottom 0.2: v22.76,20.27 24.54,20.27 24.89,19.91 24.89,12.98 25.43,12.45 33.6,12.45 34.49,11.56 34.49,6.76 35.74,5.51 49.43,5.51 50.43,4.51 56.12,4.51 R14.1
N$69
  Bottom 0.2: U2.1 37.76,26.2 37.52,25.96 36.3,25.96 Q2.X2
N$70
  Bottom 0.2: Q2.X1 33.21,25.82 34.14,24.89 38.58,24.89 39.12,25.43 39.12,27.32 U2.2
N$71
  Bottom 0.2: 40.36,27.52 U2.3
  Bottom 0.305: BAT2.VCC@1 41.85,24.47 40.36,25.96 40.36,27.52
N$79
  Bottom 0.305: T30.C 31.48,7.2 JP15.1
N$80
  Bottom 0.2: R68.1 26.04,4.35 T30.B
N$90
  Top 0.305: 49.93,7.58 49.93,11.37 U$15.1
  Top 0.813: 49.93,11.37 49.9,7.43 U$7.P$1 49.76,8.36 U$6.1
N$91
  Top 0.2: R69.2 45.52,14.4
  Top 0.305: 45.7,14.58 R69.2
  Top 0.813: C13.1 52.24,13.93 R70.2 51.83,13.95 51.38,13.51 49.96,13.51 U$15.3 49.81,13.48 48.72,14.58 45.7,14.58 R69.2
N$92
  Bottom 0.2: U$18.3 47.55,9.4 47.54,9.38 | 47.47,6.53 47.51,6.8 47.54,6.83 R71.1
  Bottom 0.305: 47.54,9.38 R71.1
  Bottom 0.813: U$18.3 47.47,6.84 47.51,6.8 | R72.2 51.65,6.6 | 51.51,6.6 51.65,6.6 | 51.65,6.6 51.71,6.66 51.41,6.95 R71.1
N$93
  Bottom 0.2: 44.77,14.08 C17.1 44.72,14.43 44.72,14.67 | 51.03,9.25 U$5.2 50.14,9.25
  Bottom 0.305: 44.77,14.08 U$18.6
  Bottom 0.813: U$18.6 44.77,14.39 44.72,14.43 46.11,15.82 48.9,15.82 | U$5.2 51.05,9.45 50.15,10.35 50.15,12.67 | 50.14,12.69 50.15,12.67 | 50.15,12.67 50.15,14.03 48.9,15.82 | U$8.P$2 52.92,17.18 51.56,15.82 48.9,15.82
N$94
  Bottom 0.2: 47.47,14.08 C17.2
  Bottom 0.813: U$18.1 47.47,14.08
RESET  (via drill 0.35)
  Top 0.2: IC2.29 23.05,18.42 22.76,18.14 v22.76,17.07
  Bottom 0.2: v22.76,17.07 22.76,11.38 22.05,10.85 22.05,8.89 JP13.5 20.61,5.1 R57.1
RX  (via drill 0.35)
  Top 0.2: v26.67,19.2 25.08,19.2 IC2.30
  Bottom 0.2: JP12.1 27.75,20.28 v26.67,19.2
SCK  (via drill 0.35)
  Top 0.2: v13.16,4.45 15.11,4.45 16.18,5.33 | 16.18,5.33 16.18,11.77 IC2.17 | 16.18,5.33 18.13,5.33 JP13.3
  Bottom 0.2: v13.16,4.45 R35.2
SCL  (via drill 0.35)
  Top 0.2: v33.07,17.42 33.07,16.16 R55.1 | IC2.28 27.05,17.62 v27.2,17.78
  Bottom 0.2: U2.6 40.3,21.45 36.98,18.14 33.6,18.14 v33.07,17.42 32.72,17.42 32,16.71 28.27,16.71 v27.2,17.78
SDA  (via drill 0.35)
  Top 0.2: R56.1 36.45,15.7 v36.45,17.25 35.38,18.49 30.76,18.49 v30.4,18.31 | v28.63,18.31 28.63,17.78 27.74,16.89 25.12,16.89 IC2.27
  Bottom 0.2: U2.5 41.57,21.66 37.34,17.25 v36.45,17.25 | v30.4,18.31 v28.63,18.31
SEG1  (via drill 0.35)
  Top 0.152: JP17.8 73.32,4.51 74.32,5.51 v74.32,35.2
  Bottom 0.152: 74.14,35.03 v74.32,35.2
  Bottom 0.2: R14.2 64.74,4.45 JP17.8 | T22.B 63.44,33.85 64.48,34.89 JP4.8
  Bottom 0.254: v74.32,35.2 64.8,35.2 64.48,34.89
SEG2  (via drill 0.35)
  Top 0.152: JP16.1 6.82,24.83 5.87,25.78 5.87,51.1 v1.49,55.47
  Bottom 0.152: 1.57,55.4 1.54,55.43 v1.49,55.47
  Bottom 0.2: R24.1 7.92,24.89 JP16.1 | T15.B 17.78,55.67 17.6,56.01 17.25,56.72 13.69,56.72 12.98,55.47 9.53,55.4 JP3.1
  Bottom 0.254: JP3.1 1.57,55.4 1.54,55.43
SEG3  (via drill 0.35)
  Top 0.152: 1.42,52.98 v1.49,52.98 5.33,49.15 5.33,23.29 6.33,22.29 JP16.2
  Bottom 0.152: 1.62,52.86 1.55,52.93 v1.49,52.98
  Bottom 0.2: R25.1 7.92,22.23 JP16.2 | T17.B 12.98,54.23 10.46,54.23 JP3.2
  Bottom 0.254: JP3.2 1.62,52.86 1.55,52.93
SEG4  (via drill 0.35)
  Top 0.152: JP16.3 5.67,19.75 4.8,20.62 4.8,47.01 v1.49,50.32
  Bottom 0.2: R26.1 7.87,19.74 JP16.3 | T18.B 9.72,50.94 JP3.3
  Bottom 0.254: JP3.3 v1.49,50.32
SEG5  (via drill 0.35)
  Top 0.152: 1.42,47.83 v1.49,47.83 4.27,45.05 4.27,18.49 5.55,17.21 JP16.4
  Bottom 0.152: 8.87,48.01 9.17,47.7 | 1.54,47.78 v1.49,47.83
  Bottom 0.2: R28.1 7.89,17.25 JP16.4 | T16.B 9.31,47.56 9.17,47.7 JP3.4
  Bottom 0.254: JP3.4 1.54,47.78
SEG6  (via drill 0.35)
  Top 0.152: JP16.5 4.71,14.67 3.73,15.65 3.73,43.03 v1.6,45.16
  Bottom 0.152: 8.99,45.34 9.11,45.22 | 1.68,45.24 1.66,45.22 v1.6,45.16
  Bottom 0.2: R30.1 7.95,14.76 JP16.5 | T21.B 10.14,44.19 9.11,45.22 JP3.5
  Bottom 0.254: JP3.5 1.68,45.24 1.66,45.22
SEG7  (via drill 0.35)
  Top 0.152: JP16.6 4.23,12.13 3.2,13.16 3.2,41.07 v1.6,42.67
  Bottom 0.152: 9.07,42.67 JP3.6 | 1.63,42.7 v1.6,42.67
  Bottom 0.2: R33.1 7.9,12.09 JP16.6 | T19.B 11.01,40.78 JP3.6
  Bottom 0.254: JP3.6 1.63,42.7
SEG8  (via drill 0.35)
  Top 0.152: JP16.7 3.74,9.59 2.67,10.67 2.67,34.42 2.79,34.9 2.79,38.99 v1.6,40.18
  Bottom 0.152: 9.07,40.18 JP3.7 | v1.6,40.18 1.63,40.16
  Bottom 0.2: R32.1 7.87,9.6 JP16.7 | T24.B 11.8,37.62 10.67,38.76 10.67,39.47 10.49,39.65 9.6,39.65 JP3.7
  Bottom 0.254: JP3.7 1.63,40.16 v1.6,40.18
SEG9  (via drill 0.35)
  Top 0.152: JP16.8 8.87,7.11 2.85,7.11 2.13,7.82 2.13,34.67 2.49,35.03 2.49,36.8 v1.6,37.69
  Bottom 0.152: 9.02,37.69 JP3.8 | 1.68,37.62 v1.6,37.69
  Bottom 0.2: R34.1 7.92,7.11 JP16.8 | T20.B 14.82,34.08 14.05,34.85 11.86,34.85 JP3.8
  Bottom 0.254: JP3.8 1.68,37.62
  Bottom 0.305: 14.82,33.31 T20.B
SEG10  (via drill 0.35)
  Top 0.152: v1.6,35.2 1.6,6.22 3.38,4.45 8.86,4.45 JP16.9
  Bottom 0.152: 8.97,35.2 9.2,34.97 | 1.73,35.08 1.67,35.14 v1.6,35.2
  Bottom 0.2: R35.1 7.92,4.45 JP16.9 | 18.65,33.06 T23.B 18.65,33.23 17.78,32.36 11.81,32.36 9.2,34.97 JP3.9
  Bottom 0.254: JP3.9 1.73,35.08 1.67,35.14
SEGMENT-A  (via drill 0.35)
  Top 0.2: v17.8,37.9 v27.96,37.9 v34.7,37.9 v43.61,37.9 51.23,37.9 54.23,40.89 54.23,42.54 U$4.8
  Bottom 0.2: v17.8,37.9 17.98,38.42 17.98,41.41 | v27.96,37.9 28.67,38.42 28.67,41.25 | v43.61,37.9 43.61,38.6 43.61,42.58 U$3.8 | v17.8,37.9 17.75,37.85 17.78,37.82 | v17.8,37.9 16.33,37.9 14.05,40.18 14.05,41.69 T19.C | R5.1 36.51,36.05 35.6,36.05 34.67,36.98 34.67,37.87 v34.7,37.9 | 28.67,41.41 28.67,41.25 | 28.67,41.25 28.67,42.58 U$2.8
  Bottom 0.203: 17.98,41.41 17.98,42.63 U$1.8
SEGMENT-B  (via drill 0.35)
  Top 0.2: v16.54,39.17 v26.47,39.17 v42.52,39.17 50.9,39.17 52.98,41.25 52.98,43.3 U$4.9
  Top 0.254: v14.22,47.3 14.22,44.27 15.29,43.2 16.71,43.27 U$1.9
  Bottom 0.2: v16.54,39.17 16.66,39.83 16.66,41.41 | v26.47,39.17 27.36,39.88 27.36,43.27 U$2.9 | 14.34,48.17 14.4,48.12 | R2.1 37.77,39.65 39.65,39.65 40.13,39.17 v42.52,39.17 42.49,40.93 42.49,43.28 U$3.9
  Bottom 0.203: 16.66,41.41 16.66,43.32 U$1.9
  Bottom 0.254: 14.34,48.17 T16.C 14,47.52 v14.22,47.3
SEGMENT-C  (via drill 0.35)
  Top 0.2: v26.85,54.94 23.29,54.94 v18.98,50.63 17.25,48.9 17.25,48.46 U$1.13
  Top 0.203: v52.27,54.94 v41.72,54.94 v26.85,54.94
  Bottom 0.2: U$2.13 28.07,48.73 27.2,49.61 27.2,54.59 v26.85,54.94 | U$3.13 42.77,48.44 41.62,49.59 | 41.62,49.59 41.6,49.61 41.6,54.82 v41.72,54.94 | R4.1 39.27,45.85 40.18,46.76 40.18,48.16 41.62,49.59
  Bottom 0.203: v52.27,54.94 52.27,49.84 U$4.13
  Bottom 0.254: T18.C 17.72,51.89 v18.98,50.63
SEGMENT-D  (via drill 0.35)
  Top 0.2: v30.45,51.56 v45.21,51.56 v56.08,51.56
  Top 0.203: 21.55,47.51 25.6,51.56 v30.45,51.56
  Top 0.254: U$1.3 21.5,47.46 21.55,47.51 | v23.11,45.52 23.11,44.09 20.62,41.6 15.82,41.6 13.51,43.92 13.51,49.43 v17.07,52.98
  Bottom 0.2: 38.71,55.32 R3.1 | 38.71,55.32 38.59,55.32 38.38,55.53 38.38,55.82 38.59,56.03 38.6,56.03 | U$2.3 32.07,48.66 30.58,50.14 30.58,51.44 v30.45,51.56 | U$3.3 46.94,47.52 46.94,48.72 45.21,50.44 v45.21,51.56 45.21,52.58 42.14,55.65 39.03,55.65 38.71,55.32 | v56.08,51.56 56.08,50.24 57.61,48.72 57.61,47.52 U$4.3
  Bottom 0.254: U$1.3 21.89,47.46 23.11,46.23 v23.11,45.52 | v17.07,52.98 15.59,52.98 T17.C
SEGMENT-DP  (via drill 0.35)
  Top 0.2: v15.29,40.54 15.39,40.44 v25.36,40.44 v41.63,40.44 51.1,40.44 52.09,41.43 52.09,44.47 U$4.10
  Bottom 0.2: v25.36,40.44 25.43,40.5 25.43,41.25 | 41.63,40.67 v41.63,40.44 41.63,42.29 41.25,42.67 41.25,44.29 U$3.10 | 15.55,40.28 v15.29,40.54 15.29,41.41 | R7.1 38.96,41.05 39.65,40.36 41.32,40.36 41.63,40.67 | 14.56,45.14 T21.C 14.11,44.98 15.47,44.98 15.77,44.68 U$1.10 | 41.63,40.67 41.63,40.91 | 25.43,41.41 25.43,43.4 U$2.10
  Bottom 0.203: 25.43,41.41 25.43,41.25 | 15.29,41.41 15.29,44.12 U$1.10
SEGMENT-E  (via drill 0.35)
  Top 0.2: 26.16,50.6 v31.36,50.6 v37.1,50.6 v46.15,50.6 48.31,50.6 | 48.54,50.6 v57.16,50.6 57.23,50.6
  Top 0.203: U$1.4 21.75,46.18 26.16,50.6
  Top 0.254: 48.54,50.6 48.31,50.6
  Bottom 0.2: 45.79,50.56 v46.15,50.6 46.15,50.22 47.65,48.72 47.65,48.36 48.18,47.83 48.18,46.73 U$3.4 | T22.C 55.78,39.78 59.74,43.56 59.65,46.14 59.56,48.38 v57.16,50.6 | R11.1 37.23,50.47 37.16,50.53 | 37.16,50.53 v37.1,50.6 | U$2.4 33.44,46.07 35.03,47.65 36.63,47.65 37.16,48.18 37.16,50.52 37.16,50.53
  Bottom 0.254: U$4.4 59.58,46.07 59.65,46.14
SEGMENT-F  (via drill 0.35)
  Top 0.2: v20.34,35.36 v30.5,35.36 v45.72,35.36 51.36,35.36 57.07,41.07 57.07,43.27 U$4.6
  Bottom 0.2: v30.5,35.36 31.47,36.32 31.47,43.27 U$2.6 | T23.C 17.7,35.64 17.78,35.56 20.3,35.53 v20.34,35.36 20.77,36.14 20.77,41.41 | R13.1 45.52,35.2 v45.72,35.36 46.4,36.04 46.4,40.89 | 46.4,41.06 46.4,40.89 | 46.4,40.89 46.4,43.27 U$3.6
  Bottom 0.203: 20.77,41.41 20.77,43.32 U$1.6
SEGMENT-G  (via drill 0.35)
  Top 0.2: v29.17,52.6 v44.17,52.6 v54.86,52.6 | U$2.2 32.28,48.44 32.99,47.73 33.43,47.3 33.43,45.16 33.78,44.63 36.45,44.63 v36.5,44.58
  Top 0.203: v29.17,52.6 24.27,52.6 v21.46,49.79 U$1.2
  Bottom 0.2: R1.1 v36.5,44.58 | U$2.2 30.95,49.05 29.16,50.85 29.16,52.59 v29.17,52.6 | U$3.2 45.89,48.7 44.09,50.49 44.09,52.53 v44.17,52.6 | U$4.2 56.56,48.88 54.94,50.49 54.94,52.53 v54.86,52.6
  Bottom 0.254: T15.C 18.69,52.55 v21.46,49.79
SEGMENT-H  (via drill 0.35)
  Top 0.2: 19.28,36.63 v29.23,36.63 v44.57,36.63 51.38,36.63 55.65,40.72 55.65,41.25 | 19.28,36.63 v19.19,36.63 19.07,36.63 | 19.18,36.73 19.28,36.63 | 55.65,41.25 55.65,41.35 | 55.65,41.25 55.65,42.48 U$4.7
  Bottom 0.2: v29.23,36.63 30.16,37.37 30.16,42.58 U$2.7 | 44.67,36.75 45.09,37.32 45.09,40.89 | 44.67,36.75 v44.57,36.63 | T24.C 15.22,37.16 18.31,37.16 18.85,36.63 v19.19,36.63 19.46,37.26 19.46,41.41 | R15.1 39.09,36.07 39.65,36.63 44.54,36.63 44.67,36.75 | 45.09,41.02 45.09,40.89 | 45.09,40.89 45.09,42.58 U$3.7
  Bottom 0.203: 19.46,41.41 19.46,42.63 U$1.7
SEGMENT-Q  (via drill 0.35)
  Top 0.2: 21.64,34.09 v31.77,34.09 v46.87,34.09 51.51,34.09 56.71,39.28 58.42,40.96 58.4,41.31 58.4,44.21 U$4.5 | 21.64,34.09 v21.61,34.09 18.01,34.09 v15.82,36.27 | 21.34,33.79 21.64,34.09
  Bottom 0.2: v21.61,34.09 21.61,34.42 22.05,34.85 22.13,41.41 | v31.77,34.09 32.31,34.62 32.31,41.25 | v15.82,36.27 14.22,36.27 T20.C | R6.1 46.03,33.25 v46.87,34.09 47.25,34.64 47.25,42.45 47.65,42.85 47.65,44.29 U$3.5 | 32.31,41.41 32.31,41.25 | 32.31,41.25 32.31,42.45 32.72,42.85 32.72,44.29 U$2.5
  Bottom 0.203: 22.13,41.41 22.13,44.04 U$1.5
SELECT1  (via drill 0.35)
  Top 0.152: JP17.1 65.67,22.29 67.92,23.82 67.92,45.87 v74.32,52.81
  Top 0.2: IC2.26 26.43,16.02 v26.53,16.12 | v28.98,56.54 29.69,55.65 48.12,55.65 50.61,57.43 62.05,57.43 63.02,56.46 63.02,52.73 JP4.1
  Bottom 0.2: 36.64,16.12 36.68,16.16 36.69,16.16 | v26.53,16.12 36.66,16.12 36.69,16.16 | 36.69,16.16 36.72,16.18 | 36.69,16.16 37.31,16.16 42.85,21.34 64.03,21.34 JP17.1 | v28.98,56.54 24.36,56.54 24.71,56.18 R16.2
  Bottom 0.254: JP4.1 v74.32,52.81
SELECT1D
  Bottom 0.2: 24,52.74 R16.1 24.36,52.98 24.36,50.67 24.75,50.28 T25.B
SELECT2  (via drill 0.35)
  Top 0.152: JP17.3 68.24,17.21 69.52,18.49 69.52,43.03 v74.32,47.83
  Top 0.2: IC2.24 25.82,13.73 v26.49,14.4 | v50.85,56.19 52.63,56.19 55.47,53.87 61.7,53.87 62.23,53.16 62.23,48.18 62.87,47.73 JP4.3
  Bottom 0.152: 74.22,47.73 v74.32,47.83
  Bottom 0.2: v26.49,14.4 37.87,14.4 43.2,19.74 58.67,19.74 61.16,17.25 64.77,17.25 JP17.3 63.51,17.21 | v50.85,56.19 49.86,56.19 49.86,56.79 R9.2
  Bottom 0.254: v74.32,47.83 64.72,47.83 JP4.3
SELECT2D  (1 unrouted)
  Bottom 0.2: T26.B 35.41,53.32
SELECT3  (via drill 0.35)
  Top 0.152: JP17.2 67.05,19.75 68.63,21.16 68.63,44.45 v74.32,50.32
  Top 0.2: IC2.25 27.49,15.22 v27.56,15.29 | v44.63,57.43 v36.8,57.43
  Bottom 0.152: 74.27,50.27 v74.32,50.32
  Bottom 0.2: v27.56,15.29 37.52,15.29 43.2,20.62 59.21,20.45 60.1,19.74 62.73,19.74 64.88,19.75 JP17.2 63.64,19.75 | v36.8,57.43 35.84,57.43 35.43,56.66 35.43,56.83 35.38,56.78 R8.2 | v44.63,57.43 61.52,57.43 62.41,56.54 62.41,51.03 63.3,50.14 64.49,50.14 JP4.2
  Bottom 0.254: v74.32,50.32 64.67,50.32 64.49,50.14
SELECT3D
  Bottom 0.2: R9.1 49.44,53.16
  Bottom 0.254: T27.B 49.65,51.52 49.25,51.92 R9.1
SELECT4  (via drill 0.35)
  Top 0.152: JP17.4 68.9,14.67 70.59,16.36 70.59,41.6 v74.32,45.34
  Top 0.2: IC2.23 22.94,13.56 22.94,12.45 23.11,12.27 26.85,12.27 27.38,12.8 v27.38,13.34 | v62.23,41.43 62.23,44.27 62.94,44.98 64.41,44.98 JP4.4
  Bottom 0.152: 74.17,45.19 v74.32,45.34
  Bottom 0.2: v27.38,13.34 37.69,13.34 43.2,18.85 58.14,18.85 60.81,16 62.23,16 63.56,14.67 JP17.4 | R10.2 61.87,41.07 v62.23,41.43
  Bottom 0.254: v74.32,45.34 64.77,45.34 JP4.4
SELECT4.1D
  Bottom 0.2: R10.1 59.03,41.78 60.45,43.2 60.45,54.41 60.1,54.76 58.42,54.76 T28.B
TX  (via drill 0.35)
  Top 0.2: IC2.31 25.94,20.02 26.66,20.56 v26.66,21.83
  Bottom 0.2: v26.66,21.83 26.66,25.19 25.21,26.28 JP12.2
VCC  (via drill 0.35)
  Top 0.2: 47.23,11.63 U$15.5 47.3,11.52 | 41.96,8.36 v41.96,8.51 | 41.96,10.65 41.96,10.97 | 41.96,10.97 C14.1 | 36.46,10.55 JP18.1 41.37,10.37 | 41.96,10.97 41.9,10.9 41.96,10.84
  Top 0.305: 43.09,7.29 43.03,7.29 41.96,8.36 | 47.3,11.52 47.3,10.31 | 36.46,10.55 JP15.2 | 41.9,10.9 41.37,10.37 | JP18.1 41.2,10.37 C14.1 | v41.96,8.51 41.96,10.65 41.96,10.84
  Top 0.508: 58.58,17.45 C7.2 | 58.58,17.45 C8.2 | U1.3 50.49,16.71 51.03,16.18 56.6,16.18 58.58,17.45
  Top 0.61: v44.09,16.71 U1.3
  Top 0.813: 47.23,12.05 U$15.4 | 47.23,12.05 47.23,11.63 | 47.23,12.05 47.3,11.99 47.3,10.31 45.22,8.24 U$7.P$2 43.09,7.29 41.88,8.5 C14.1 | JP15.2 41.86,10.55 41.96,10.65
  Top 1.016: R73/D3.1 43.74,16.36 v44.09,16.71
  Bottom 0.2: C16.2 41.88,10.15 41.95,10.22 42.17,10.44
  Bottom 0.305: 42.17,10.44 U$18.5
  Bottom 0.61: v44.09,16.71 42.14,16.71 36.64,11.03 JP18.1
  Bottom 0.813: U$18.4 44.77,9.96 | 44.77,9.96 U$18.5 42.18,10.44 41.96,10.22 | 41.96,10.22 v41.96,8.51 41.88,8.59 C16.2 | 41.96,10.22 41.95,10.22 | 44.77,9.96 42.08,9.96 41.88,10.15

### Text on the board
tPlace: | | | | | | | | Litan Virgil / 2017 | V1.2 | gnd | 5V | TX | RX | Litan Virgil / 2017 | V1.2 | 20v | but | vcc | vcc | 1v5 | gnd | buz | gnd | gnd